# EAGLE schematic dev board (EAGLE 7.3.0)
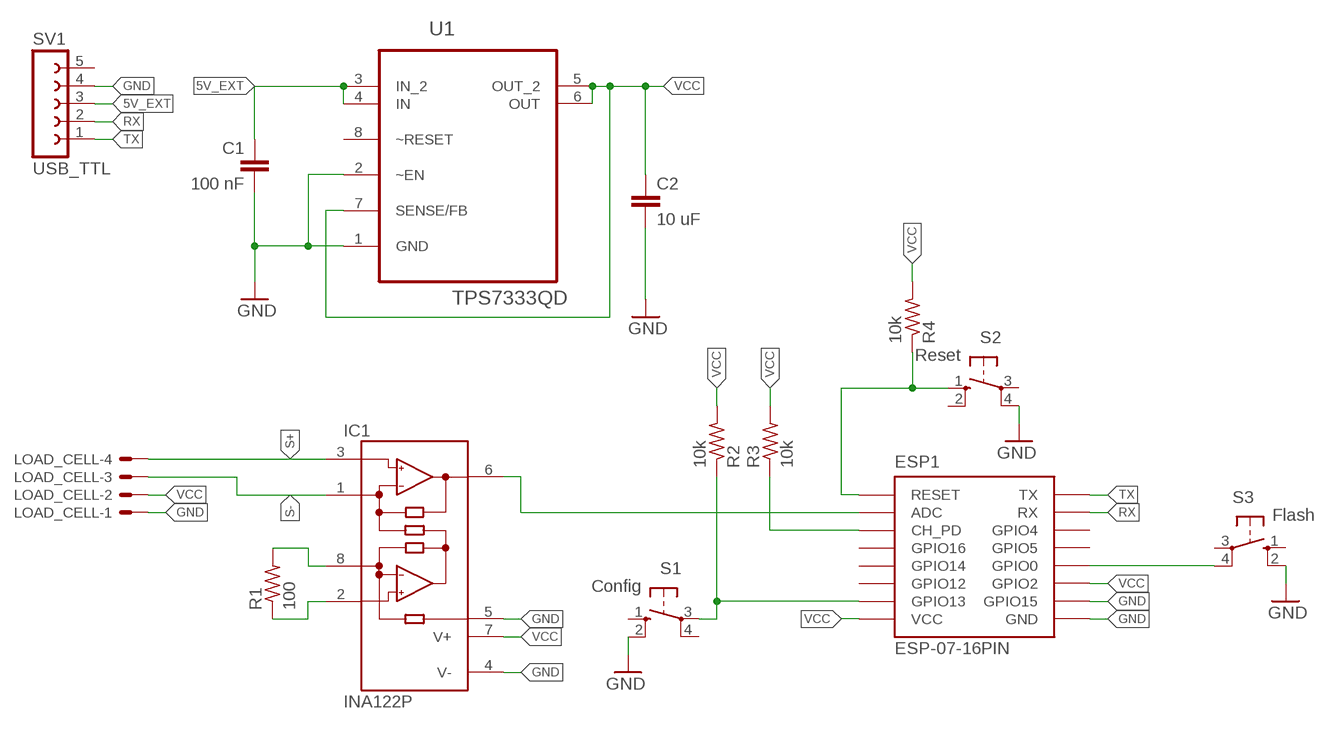
[diagram p0: schematic, sheet 1]

## Parts
C1  100 nF  C2,5-3  [C2.5-3]
C2  10 uF  C2,5-3  [C2.5-3]
ESP1  ESP-07-16PIN  [ESP-07-16PIN]
IC1  INA122P  [DIL08]
LOAD_CELL  22-23-2041  [22-23-2041]
R1  100  R-US_0204/5  [0204/5]
R2  10k  R-US_0204/5  [0204/5]
R3  10k  R-US_0204/5  [0204/5]
R4  10k  R-US_0204/5  [0204/5]
S1  Config  10-XX  [B3F-10XX]
S2  Reset  10-XX  [B3F-10XX]
S3  Flash  10-XX  [B3F-10XX]
SV1  USB_TTL  FE05W  [FE05W]
U1  TPS7333QD  [SOIC127P600X175-8N]

## Nets
5V_EXT: C1.1 SV1.3 U1.3(IN_2) U1.4(IN)
ADC: ESP1.ADC IC1.6(OUT)
GND: C1.2 C2.2 ESP1.GND ESP1.GPIO15 IC1.4(V-) IC1.5(REF) LOAD_CELL.1 S1.2(S1) S2.4(P1) S3.2(S1) SV1.4 U1.1(GND) U1.2(~EN)
GPIO0: ESP1.GPIO0 S3.4(P1)
N$1: ESP1.CH_PD R3.1
N$2: IC1.2(-IN) R1.1
N$3: IC1.8(RG) R1.2
N$4: ESP1.GPIO13 R2.1 S1.3(P)
RST: ESP1.REST(RESET) R4.1 S2.1(S)
RX: ESP1.RX SV1.2
S+: IC1.3(+IN) LOAD_CELL.4
S-: IC1.1(RG) LOAD_CELL.3
TX: ESP1.TX SV1.1
VCC: C2.1 ESP1.GPIO2 ESP1.VCC IC1.7(V+) LOAD_CELL.2 R2.2 R3.2 R4.2 U1.5(OUT_2) U1.6(OUT) U1.7(SENSE/FB)
Unconnected: ESP1.GPIO4 ESP1.GPIO5 ESP1.GPIO12 ESP1.GPIO14 ESP1.GPIO16 S1.1(S) S1.4(P1) S2.2(S1) S2.3(P) S3.1(S) S3.3(P) SV1.5 U1.8(~RESET)

## Library data of the parts
C1 C2 = capacitor-wima:C: CAPACITOR naming: grid - package width
ESP1 = esp8266modules:ESP-07-16PIN: ESP8266 Wifi Module ESP-07 - 16 pins; DIMENSIONS: 22.0 x 16.0 mm; PINS: 16; PITCH: 0.078" / 2 mm
IC1 = burr-brown:INA122: Instrumentation Amplifier Single Supply, MicroPower; MF: TEXAS INSTRUMENTS; MPN: INA122P; OC_FARNELL: 1459460; OC_NEWARK: 15M0948
LOAD_CELL = con-molex:22-23-2041: .100" (2.54mm) Center Header - 4 Pin; MF: MOLEX; MPN: 22-23-2041; OC_FARNELL: 1462920; OC_NEWARK: 38C0355
R1-R4 = resistor:R-US_: RESISTOR, American symbol
S1-S3 = switch-omron:10-XX: OMRON SWITCH; MPN: B3F-1000; OC_FARNELL: 176432; OC_NEWARK: 36M3542
SV1 = con-lsta:FE05W: FEMALE HEADER; OC_FARNELL: unknown; OC_NEWARK: unknown
U1 = Texas Instruments_By_element14_Batch_1:TPS7333QD: LOW-DROPOUT VOLTAGE REGULATORS; MPN: TPS7333QD; OC_FARNELL: -; OC_NEWARK: 52F2803; PACKAGE: SOIC-8; SUPPLIER: Texas Instruments